# Altium schematic sheet PowerReg.SchDoc
size A; SheetNumber: 6; SheetTotal: 7
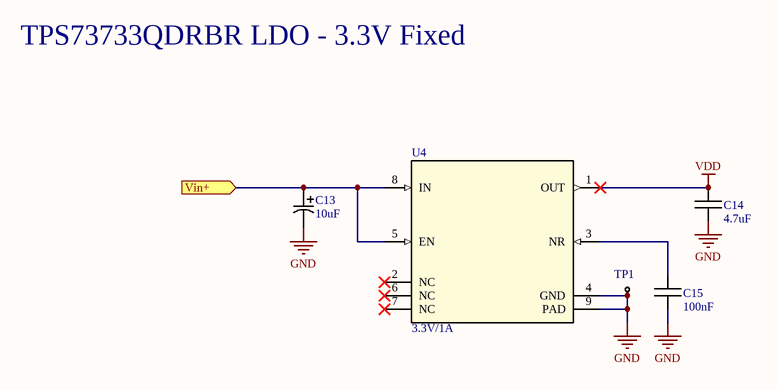
[diagram p0: PowerReg.SchDoc]

## Parts
C13  10uF  [CAP1206_TAJA]
C14  4.7uF  [CAP0805]
C15  100nF  [CAP0805]
TP1  1mm Test Point  [TP_1MM]  (value not drawn)
U4  3.3V/1A  [VSON_DRB8]

## Ports
Vin+ (in, see BoardIF[2B])

## Nets
GND: C13.2 C14.1 C15.2 TP1.1 U4.4(GND) U4.9(PAD)
VDD: C14.2 U4.1(OUT)
Vin+: C13.1 U4.5(EN) U4.8(IN) ; port Vin+
NetC15_1: C15.1 U4.3(NR)

Not connected (* = marked no-connect by the designer): U4 2(NC)* 6(NC)* 7(NC)*

## Notes on the sheet
- TPS73733QDRBR LDO - 3.3V Fixed

## Library data of the parts
C13 = TAJA106K016RNJ: Cap Tant Solid 10uF 16V A CASE 10%( 3.2 X 1.6 X 1.6mm) Inward L SMD 3216-18 3 Ohm 125C T/R; Mfr_Name: KYOCERA AVX; Type: DEV; Dielectric Material: Tantalum; Value: 10uF 16V 10% Tantalum; ESR (Equivalent Series Resistance): 3R; Leakage Current: 1.6uA; Dissipation Factor: 8%; Polarity: Polar; Frequency: 300MHz; Life (Hours): 2000Hour; Ripple Current: 158mA; Copyright: Copyright (C) 2023 Ultra Librarian. All rights reserved.; Manufacturer_Part_Number: TAJA106K016RNJ; RefDes: RefDes; Supplier: Digi-Key; Supplier Part Number: 478-1655-6-ND; Manufacturer: Kyocera AVX; Manufacturer Part Number: TAJA106K016RNJ; RoHS: Yes; Category: Tantalum Capacitors; Stock: 8878; Pricing: 1=0.35, 10=0.234, 50=0.1726, 100=0.1405, 500=0.1109, 1000=0.09365 (USD); Mounting Technology: Surface Mount,PCB; Case/Package: 1206; Pins: 2; Case Code (Metric): 3216; Case Code (Imperial): 1206; Min Operating Temperature: -55°C; Max Operating Temperature: 125°C; Tolerance: 10%; Packaging: Tape and Reel; Voltage Rating: 16V; Voltage Rating (DC): 16V; Features: General Purpose; Series: TAJ; Package Quantity: 1; Termination: SMD/SMT; Voltage: 16V; Construction: Flat; Voltage Rating (AC): 16V; Length: 3.2mm; Width: 1.6mm; Height: 1.6mm; Depth: 1.6mm; Height - Seated (Max): 0.071inch; Lead Pitch: 1.1mm; Size: 1.6mm; Radiation Hardening: No; Lead Free: Lead Free; RoHS Compliant: Yes; Reach SVHC Compliant: No; ComponentLink1URL: https://datasheet.ciiva.com/27051/1234933-27051768.pdf?src-supplier=Jameco; ComponentLink1Description: https://datasheet.ciiva.com/27051/1234933-27051768.pdf?src-supplier=Jameco; ComponentLink2URL: https://datasheet.ciiva.com/26341/559411-da-01-en-tacc-a-3-2-mm-x-1-6-mm-x-1-6-mm-10-uf-26341755.pdf?src-supplier=Conrad; ComponentLink2Description: https://datasheet.ciiva.com/26341/559411-da-01-en-tacc-a-3-2-mm-x-1-6-mm-x-1-6-mm-10-uf-26341755.pdf?src-supplier=Conrad; ComponentLink3URL: https://datasheet.ciiva.com/18710/taj-eng-18710622.pdf?src-supplier=Distrelec; ComponentLink3Description: https://datasheet.ciiva.com/18710/taj-eng-18710622.pdf?src-supplier=Distrelec; ComponentLink4URL: https://datasheet.ciiva.com/7730/1703059-7730712.pdf?src-supplier=Element14; ComponentLink4Description: https://datasheet.ciiva.com/7730/1703059-7730712.pdf?src-supplier=Element14; ComponentLink5URL: https://datasheet.ciiva.com/7730/1703059-7730713.pdf?src-supplier=Element14; ComponentLink5Description: https://datasheet.ciiva.com/7730/1703059-7730713.pdf?src-supplier=Element14; ComponentLink6URL: https://datasheet.ciiva.com/7730/taj-7730975.pdf?src-supplier=Element14; ComponentLink6Description: https://datasheet.ciiva.com/7730/taj-7730975.pdf?src-supplier=Element14; ComponentLink7URL: https://datasheet.ciiva.com/7730/1680476-7730714.pdf?src-supplier=Element14; ComponentLink7Description: https://datasheet.ciiva.com/7730/1680476-7730714.pdf?src-supplier=Element14; ComponentLink8URL: https://datasheet.ciiva.com/263/taj-263392.pdf?src-supplier=Digi-Key; ComponentLink8Description: https://datasheet.ciiva.com/263/taj-263392.pdf?src-supplier=Digi-Key; ComponentLink9URL: https://datasheet.ciiva.com/263/taj-263391.pdf?src-supplier=Digi-Key; ComponentLink9Description: https://datasheet.ciiva.com/263/taj-263391.pdf?src-supplier=Digi-Key; ComponentLink10URL: https://datasheet.ciiva.com/263/taj-263393.pdf?src-supplier=Digi-Key; ComponentLink10Description: https://datasheet.ciiva.com/263/taj-263393.pdf?src-supplier=Digi-Key; ComponentLink11URL: https://datasheet.ciiva.com/12882/taj-27497-12882509.pdf?src-supplier=Mouser; ComponentLink11Description: https://datasheet.ciiva.com/12882/taj-27497-12882509.pdf?src-supplier=Mouser; ComponentLink12URL: https://datasheet.ciiva.com/3004/taj-3004388.pdf?src-supplier=Avnet; ComponentLink12Description: https://datasheet.ciiva.com/3004/taj-3004388.pdf?src-supplier=Avnet; ComponentLink13URL: https://datasheet.ciiva.com/16379/taj-16379015.pdf?src-supplier=Future+Electronics; ComponentLink13Description: https://datasheet.ciiva.com/16379/taj-16379015.pdf?src-supplier=Future+Electronics; ComponentLink14URL: https://datasheet.ciiva.com/3004/taj-3004387.pdf?src-supplier=Avnet; ComponentLink14Description: https://datasheet.ciiva.com/3004/taj-3004387.pdf?src-supplier=Avnet; LCSC Part#: C7171
C14 = CL21A475KAQNNNE: Multilayer Ceramic Capacitor, 4.7 uF, 25 V, ± 10%, X5R, 0805 [2012 Metric]; Manufacturer: Samsung; Value: 4.7uF 25V; Voltage Rating: 25V; Supplier: Digi-Key; Supplier Part Number: 1276-1244-1-ND; Manufacturer Part Number: CL21A475KAQNNNE; RoHS: Yes; Category: Ceramic Capacitors; Stock: 3502142; Pricing: 1=0.1, 10=0.069, 50=0.0414, 100=0.0326, 500=0.02408, 1000=0.01994 (USD); Mounting Technology: Surface Mount; Case/Package: 0805; Case Code (Metric): 2012; Case Code (Imperial): 0805; Material: Ceramic; Min Operating Temperature: -55°C; Max Operating Temperature: 85°C; Packaging: Tape and Reel; Tolerance: 10%; Dielectric: X5R; Voltage Rating (DC): 25V; Series: CL; Construction: Flat; Length: 2mm; Height: 1.25mm; Depth: 1.25mm; Radiation Hardening: No; Lead Free: Lead Free; RoHS Compliant: Yes; ComponentLink1URL: https://datasheet.ciiva.com/25798/cl21a475kaqnnne-25798882.pdf?src-supplier=Digi-Key; ComponentLink1Description: https://datasheet.ciiva.com/25798/cl21a475kaqnnne-25798882.pdf?src-supplier=Digi-Key; LCSC Part#: C1779
C15 = CC0805KRX7R9BB104: Multilayer Ceramic Capacitor, 0.1 uF, 50 V, ± 10%, X7R, 0805 [2012 Metric]; Manufacturer: Yageo; Value: 100nF 50V; Voltage: 50V; Insulation Resistance: 100GR; Supplier: Digi-Key; Supplier Part Number: 311-1140-1-ND; Manufacturer Part Number: CC0805KRX7R9BB104; RoHS: Yes; Category: Ceramic Capacitors; Stock: 6426664; Pricing: 1=0.1, 10=0.07, 50=0.0418, 100=0.0329, 500=0.02428, 1000=0.0201 (USD); Mounting Technology: Surface Mount; Case/Package: 0805; Pins: 2; Case Code (Metric): 2012; Case Code (Imperial): 0805; Material: Ceramic; Min Operating Temperature: -55°C; Max Operating Temperature: 125°C; Tolerance: 10%; Dielectric: X7R; Packaging: Tape and Reel; Voltage Rating: 50V; Package Quantity: 4000; Termination: SMD/SMT; Series: CC; Length: 2mm; Height: 0.85mm; Depth: 1.25mm; Radiation Hardening: No; RoHS Compliant: Yes; Reach SVHC Compliant: No; Lead Free: Lead Free; Halogen Free: Halogen Free; ComponentLink1URL: https://datasheet.ciiva.com/11786/0900766b80d84f1d-11786009.pdf?src-supplier=Rs; ComponentLink1Description: https://datasheet.ciiva.com/11786/0900766b80d84f1d-11786009.pdf?src-supplier=Rs; ComponentLink2URL: https://datasheet.ciiva.com/46393/1734573-46393307.pdf?src-supplier=Element14; ComponentLink2Description: https://datasheet.ciiva.com/46393/1734573-46393307.pdf?src-supplier=Element14; ComponentLink3URL: https://datasheet.ciiva.com/155/mlccorderingcode-155930.pdf?src-supplier=Digi-Key; ComponentLink3Description: https://datasheet.ciiva.com/155/mlccorderingcode-155930.pdf?src-supplier=Digi-Key; ComponentLink4URL: https://datasheet.ciiva.com/155/mlccorderingcode-155929.pdf?src-supplier=Digi-Key; ComponentLink4Description: https://datasheet.ciiva.com/155/mlccorderingcode-155929.pdf?src-supplier=Digi-Key; ComponentLink5URL: https://datasheet.ciiva.com/155/mlccorderingcode-155931.pdf?src-supplier=Digi-Key; ComponentLink5Description: https://datasheet.ciiva.com/155/mlccorderingcode-155931.pdf?src-supplier=Digi-Key; ComponentLink6URL: https://datasheet.ciiva.com/11464/upy-gphc-x7r-6-3v-to-50v-8-11464757.pdf?src-supplier=Avnet; ComponentLink6Description: https://datasheet.ciiva.com/11464/upy-gphc-x7r-6-3v-to-50v-8-11464757.pdf?src-supplier=Avnet; ComponentLink7URL: https://datasheet.ciiva.com/28450/1489800-28450805.pdf?src-supplier=Element14; ComponentLink7Description: https://datasheet.ciiva.com/28450/1489800-28450805.pdf?src-supplier=Element14; ComponentLink8URL: https://datasheet.ciiva.com/29242/445210-da-01-en-kerko-chip-0805-x7r-0-1uf-10proz-50vg-29242074.pdf?src-supplier=Conrad; ComponentLink8Description: https://datasheet.ciiva.com/29242/445210-da-01-en-kerko-chip-0805-x7r-0-1uf-10proz-50vg-29242074.pdf?src-supplier=Conrad; LCSC Part#: C49678
TP1 = TestPoint_1mm
U4 = TPS73733QDRBRQ1: Automotive 1-A, ultra-low-dropout voltage regulator with reverse current protection & enable; Manufacturer: Texas Instruments; Max Power Dissipation: 2.5W; Number of Outputs: 1; Output Voltage: 3.3V; Dropout Voltage: 130mV; Output Current: 1A; Max Supply Voltage: 5.5V; Min Input Voltage: 2.2V; Min Current Limit: 1.05A; Polarity: Positive; Accuracy: 3%; Output Voltage Accuracy: 1%; Quiescent Current: 300uA; Output Type: Fixed; Supplier: Digi-Key; Supplier Part Number: 296-24157-1-ND; Manufacturer Part Number: TPS73733QDRBRQ1; RoHS: Yes; Category: Voltage Regulators - Linear; Stock: 24609; Pricing: 1=2.06, 10=1.847, 25=1.7424, 100=1.4844, 250=1.3938, 500=1.21958, 1000=1.0105 (USD); Case/Package: SON; Pins: 8; Min Operating Temperature: -40°C; Max Operating Temperature: 125°C; Packaging: Tape and Reel; Package Quantity: 1; Max Output current: 1A; Number of Regulators: 1; Nominal Output Voltage: 3.3V; Power Dissipation: 2.5W; Min Output Voltage: 3.3V; Max Output Voltage: 3.3V; Series: Automotive, AEC-Q100; Length: 3mm; Width: 3mm; Height: 1mm; Thickness: 880um; Radiation Hardening: No; Reach SVHC Compliant: No; Lead Free: Lead Free; RoHS Compliant: Yes; ComponentLink1URL: https://datasheet.ciiva.com/2045/tps73719-q1-2045686.pdf?src-supplier=Digi-Key; ComponentLink1Description: https://datasheet.ciiva.com/2045/tps73719-q1-2045686.pdf?src-supplier=Digi-Key; ComponentLink2URL: https://datasheet.ciiva.com/3224/tps73733-q1-3224372.pdf?src-supplier=Avnet; ComponentLink2Description: https://datasheet.ciiva.com/3224/tps73733-q1-3224372.pdf?src-supplier=Avnet; ComponentLink3URL: https://datasheet.ciiva.com/4888/sbvs123-125968-4888332.pdf?src-supplier=Mouser; ComponentLink3Description: https://datasheet.ciiva.com/4888/sbvs123-125968-4888332.pdf?src-supplier=Mouser; ComponentLink4URL: https://datasheet.ciiva.com/14277/sbvs123-14277182.pdf?src-supplier=Avnet; ComponentLink4Description: https://datasheet.ciiva.com/14277/sbvs123-14277182.pdf?src-supplier=Avnet; LCSC Part#: C523768; Value: TPS73733QDRBRQ1